# Altium schematic sheet Analog_Power_Board.SchDoc
size A3
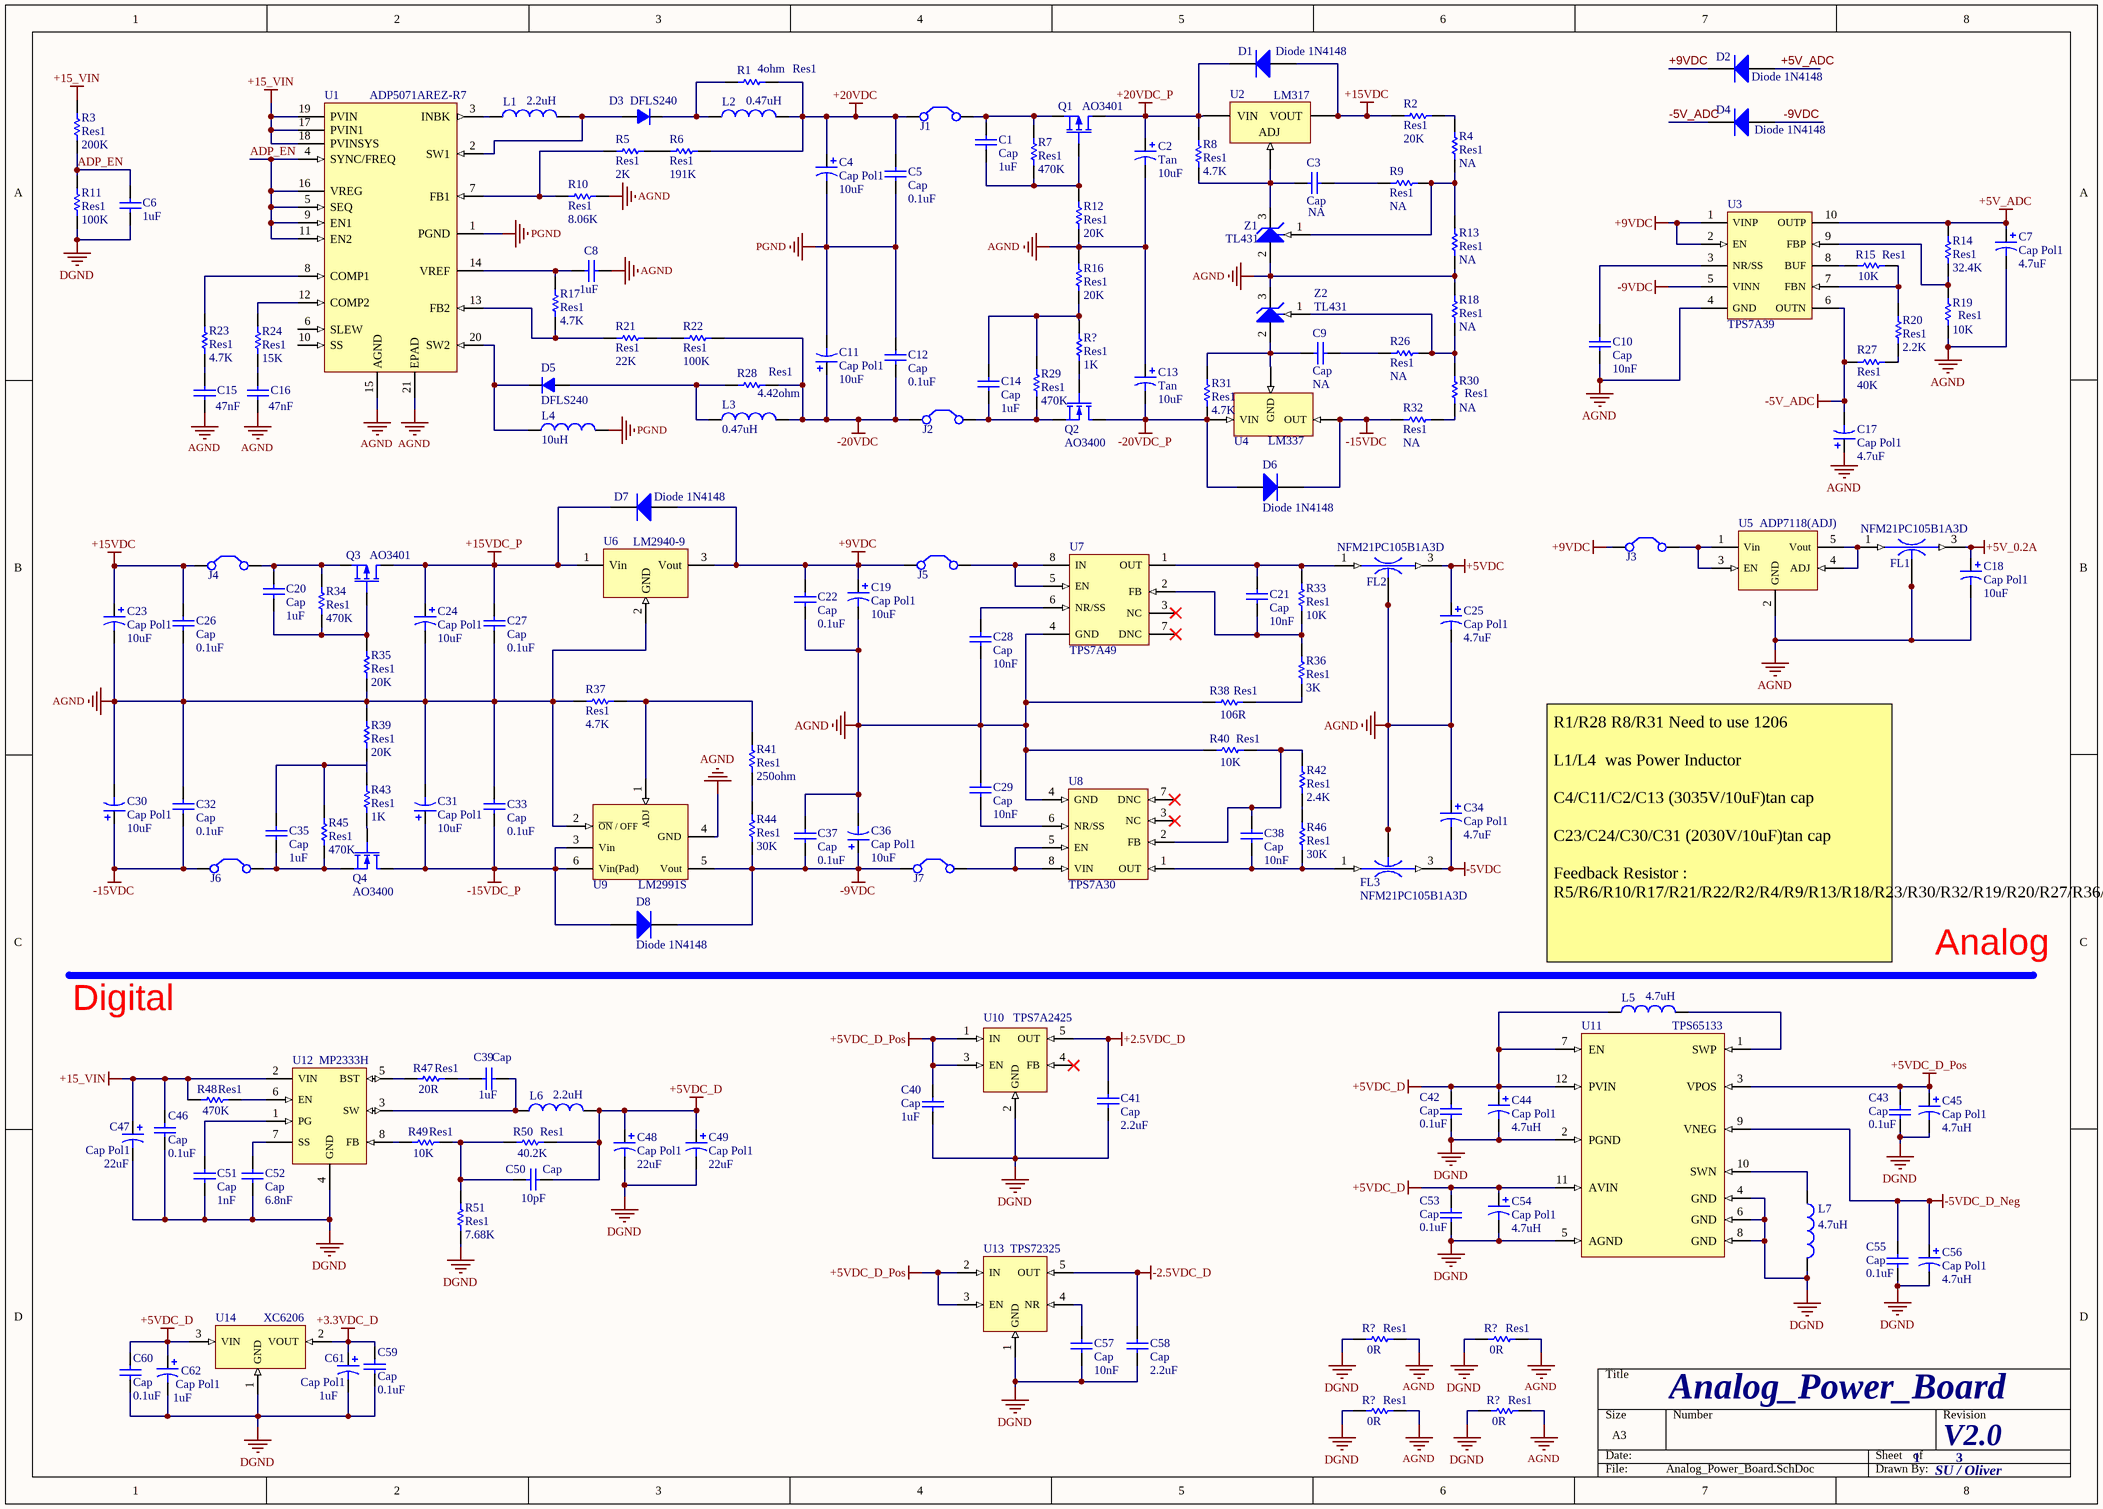
[diagram p0: Analog_Power_Board.SchDoc]

## Parts
(Parts that share a designator on the sheet are numbered #1, #2 ... from top to bottom, then left to right.)
C1  Cap  value 1uF  [C0603]
C2  Tan  value 10uF  [RB7.6-15]
C3  Cap  value NA  [C0603]
C4  Cap Pol1  value 10uF  [RB7.6-15]
C5  Cap  value 0.1uF  [C0603]
C6  value 1uF  [C0603]  (hidden comment: Cap)
C7  Cap Pol1  value 4.7uF  [RB7.6-15]
C8  value 1uF  [C0603]  (hidden comment: Cap)
C9  Cap  value NA  [C0603]
C10  Cap  value 10nF  [C0603]
C11  Cap Pol1  value 10uF  [RB7.6-15]
C12  Cap  value 0.1uF  [C0603]
C13  Tan  value 10uF  [RB7.6-15]
C14  Cap  value 1uF  [C0603]
C15  value 47nF  [C0603]  (hidden comment: Cap)
C16  value 47nF  [C0603]  (hidden comment: Cap)
C17  Cap Pol1  value 4.7uF  [RB7.6-15]
C18  Cap Pol1  value 10uF  [RB7.6-15]
C19  Cap Pol1  value 10uF  [RB7.6-15]
C20  Cap  value 1uF  [C0603]
C21  Cap  value 10nF  [C0603]
C22  Cap  value 0.1uF  [C0603]
C23  Cap Pol1  value 10uF  [RB7.6-15]
C24  Cap Pol1  value 10uF  [RB7.6-15]
C25  Cap Pol1  value 4.7uF  [RB7.6-15]
C26  Cap  value 0.1uF  [C0603]
C27  Cap  value 0.1uF  [C0603]
C28  Cap  value 10nF  [C0603]
C29  Cap  value 10nF  [C0603]
C30  Cap Pol1  value 10uF  [RB7.6-15]
C31  Cap Pol1  value 10uF  [RB7.6-15]
C32  Cap  value 0.1uF  [C0603]
C33  Cap  value 0.1uF  [C0603]
C34  Cap Pol1  value 4.7uF  [RB7.6-15]
C35  Cap  value 1uF  [C0603]
C36  Cap Pol1  value 10uF  [RB7.6-15]
C37  Cap  value 0.1uF  [C0603]
C38  Cap  value 10nF  [C0603]
C39  Cap  value 1uF  [C0603]
C40  Cap  value 1uF  [C0603]
C41  Cap  value 2.2uF  [C0603]
C42  Cap  value 0.1uF  [C0603]
C43  Cap  value 0.1uF  [C0603]
C44  Cap Pol1  value 4.7uH  [RB7.6-15]
C45  Cap Pol1  value 4.7uH  [RB7.6-15]
C46  Cap  value 0.1uF  [C0603]
C47  Cap Pol1  value 22uF  [RB7.6-15]
C48  Cap Pol1  value 22uF  [RB7.6-15]
C49  Cap Pol1  value 22uF  [RB7.6-15]
C50  Cap  value 10pF  [C0603]
C51  Cap  value 1nF  [C0603]
C52  Cap  value 6.8nF  [C0603]
C53  Cap  value 0.1uF  [C0603]
C54  Cap Pol1  value 4.7uH  [RB7.6-15]
C55  Cap  value 0.1uF  [C0603]
C56  Cap Pol1  value 4.7uH  [RB7.6-15]
C57  Cap  value 10nF  [C0603]
C58  Cap  value 2.2uF  [C0603]
C59  Cap  value 0.1uF  [C0603]
C60  Cap  value 0.1uF  [C0603]
C61  Cap Pol1  value 1uF  [RB7.6-15]
C62  Cap Pol1  value 1uF  [RB7.6-15]
D1  Diode 1N4148  [SOD-123]
D2  Diode 1N4148  [SOD-123]
D3  DFLS240  [DO-214AB]
D4  Diode 1N4148  [SOD-123]
D5  DFLS240  [DO-214AB]
D6  Diode 1N4148  [SOD-123]
D7  Diode 1N4148  [SOD-123]
D8  Diode 1N4148  [SOD-123]
FL1  NFM21PC105B1A3D  [NFM21PC105B1C3D]
FL2  NFM21PC105B1A3D  [NFM21PC105B1C3D]
FL3  NFM21PC105B1A3D  [NFM21PC105B1C3D]
J1  Jumper  [Jumper(Keystone_5015)]  (value not drawn)
J2  Jumper  [Jumper(Keystone_5015)]  (value not drawn)
J3  Jumper  [Jumper(Keystone_5015)]  (value not drawn)
J4  Jumper  [Jumper(Keystone_5015)]  (value not drawn)
J5  Jumper  [Jumper(Keystone_5015)]  (value not drawn)
J6  Jumper  [Jumper(Keystone_5015)]  (value not drawn)
J7  Jumper  [Jumper(Keystone_5015)]  (value not drawn)
L1  value 2.2uH  [0402-A]  (hidden comment: Inductor)
L2  value 0.47uH  [0402-A]  (hidden comment: Inductor)
L3  value 0.47uH  [0402-A]  (hidden comment: Inductor)
L4  value 10uH  [0402-A]  (hidden comment: Inductor)
L5  value 4.7uH  [0402-A]  (hidden comment: Inductor)
L6  value 2.2uH  [0402-A]  (hidden comment: Inductor)
L7  value 4.7uH  [0402-A]  (hidden comment: Inductor)
Q1  AO3401  [SOT23-3]
Q2  AO3400  [NMOS_SOT23]
Q3  AO3401  [SOT23-3]
Q4  AO3400  [NMOS_SOT23]
R1  Res1  value 4ohm  [R0603]
R2  Res1  value 20K  [R0603]
R3  Res1  value 200K  [R0603]
R4  Res1  value NA  [R0603]
R5  Res1  value 2K  [R0603]
R6  Res1  value 191K  [R0603]
R7  Res1  value 470K  [R0603]
R8  Res1  value 4.7K  [R0603]
R9  Res1  value NA  [R0603]
R10  Res1  value 8.06K  [R0603]
R11  Res1  value 100K  [R0603]
R12  Res1  value 20K  [R0603]
R13  Res1  value NA  [R0603]
R14  Res1  value 32.4K  [R0603]
R15  Res1  value 10K  [R0603]
R16  Res1  value 20K  [R0603]
R17  Res1  value 4.7K  [R0603]
R18  Res1  value NA  [R0603]
R19  Res1  value 10K  [R0603]
R20  Res1  value 2.2K  [R0603]
R21  Res1  value 22K  [R0603]
R22  Res1  value 100K  [R0603]
R23  Res1  value 4.7K  [R0603]
R24  Res1  value 15K  [R0603]
R26  Res1  value NA  [R0603]
R27  Res1  value 40K  [R0603]
R28  Res1  value 4.42ohm  [R0603]
R29  Res1  value 470K  [R0603]
R30  Res1  value NA  [R0603]
R31  Res1  value 4.7K  [R0603]
R32  Res1  value NA  [R0603]
R33  Res1  value 10K  [R0603]
R34  Res1  value 470K  [R0603]
R35  Res1  value 20K  [R0603]
R36  Res1  value 3K  [R0603]
R37  Res1  value 4.7K  [R0603]
R38  Res1  value 106R  [R0603]
R39  Res1  value 20K  [R0603]
R40  Res1  value 10K  [R0603]
R41  Res1  value 250ohm  [R0603]
R42  Res1  value 2.4K  [R0603]
R43  Res1  value 1K  [R0603]
R44  Res1  value 30K  [R0603]
R45  Res1  value 470K  [R0603]
R46  Res1  value 30K  [R0603]
R47  Res1  value 20R  [R0603]
R48  Res1  value 470K  [R0603]
R49  Res1  value 10K  [R0603]
R50  Res1  value 40.2K  [R0603]
R51  Res1  value 7.68K  [R0603]
R?#1  Res1  value 1K  [R0603]
R?#2  Res1  value 0R  [R0603]
R?#3  Res1  value 0R  [R0603]
R?#4  Res1  value 0R  [R0603]
R?#5  Res1  value 0R  [R0603]
U1  ADP5071AREZ-R7  [TSSOP-20-PAD]
U2  LM317  [TO-252-2-L]
U3  TPS7A39
U4  LM337  [TO-252-2-L]
U5  ADP7118(ADJ)
U6  LM2940-9
U7  TPS7A49
U8  TPS7A30
U9  LM2991S
U10  TPS7A2425
U11  TPS65133  [WSON-12]
U12  MP2333H
U13  TPS72325
U14  XC6206
Z1  TL431  [SOT-89]
Z2  TL431  [SOT-89]

## Nets
+2.5VDC_D: C41.2 U10.5(OUT)
+3.3VDC_D: C59.1 C61.1 U14.2(VOUT)
+5V_0.2A: C18.1 FL1.3(OUT)
+5V_ADC: C7.1 D2.1(A) R14.2 U3.10(OUTP)
+5VDC: C25.1 FL2.3(OUT)
+5VDC_D: C42.1 C44.1 C48.1 C49.1 C50.1 C53.1 C54.1 C60.1 C62.1 L5.1 L6.2 R50.1 U11.7(EN) U11.11(AVIN) U11.12(PVIN) U14.3(VIN)
+5VDC_D_Pos: C40.1 C43.1 C45.1 U10.1(IN) U10.3(EN) U11.3(VPOS) U13.2(IN) U13.3(EN)
+9VDC: C19.1 C22.1 D2.2(K) D7.1(A) J3.1(C1) J5.1(C1) U3.1(VINP) U3.2(EN) U6.3(Vout)
+15_VIN: C46.1 C47.1 R3.2 R48.2 U1.17(PVIN1) U1.18(PVINSYS) U1.19(PVIN) U12.2(VIN)
+15VDC: C23.1 C26.2 D1.1(A) J4.1(C1) R2.1 U2.4(VOUT)
+15VDC_P: C24.1 C27.2 D7.2(K) Q3.3(D) U6.1(Vin)
+20VDC: C4.1 C5.2 J1.1(C1) L2.2 R1.1 R6.1
+20VDC_P: C2.1 D1.2(K) Q1.3(D) R8.2 U2.3(VIN)
-2.5VDC_D: C58.2 U13.5(OUT)
-5V_ADC: C17.2 D4.2(K) R27.1 U3.6(OUTN)
-5VDC: C34.2 FL3.3(OUT)
-5VDC_D_Neg: C55.1 C56.1 U11.9(VNEG)
-9VDC: C36.1 C37.1 D4.1(A) D8.2(K) J7.1(C1) R44.1 U3.5(VINN) U9.5(Vout)
-15VDC: C30.1 C32.1 D6.2(K) J6.1(C1) R32.2 U4.3(OUT)
-15VDC_P: C31.1 C33.1 D8.1(A) Q4.3(D) U9.3(Vin) U9.6(Vin(Pad))
-20VDC: C11.1 C12.1 J2.1(C1) L3.2 R22.2 R28.1
-20VDC_P: C13.2 D6.1(A) Q2.3(D) R31.2 U4.4(VIN)
AGND: C2.2 C7.2 C8.2 C10.1 C13.1 C15.1 C16.1 C17.1 C18.2 C19.2 C22.2 C23.2 C24.2 C25.2 C26.1 C27.1 C28.2 C29.2 C30.2 C31.2 C32.2 C33.2 C34.1 C36.2 C37.2 FL1.2(GND) FL1.2_1(GND) FL1.2_3(GND) FL2.2(GND) FL2.2_1(GND) FL2.2_3(GND) FL3.2(GND) FL3.2_1(GND) FL3.2_3(GND) R10.1 R12.2 R13.2 R16.1 R18.2 R19.1 R35.2 R37.2 R38.2 R39.1 R40.2 R?#2.1 R?#3.1 R?#4.1 R?#5.1 U1.15(AGND) U1.21(EPAD) U3.4(GND) U5.2(GND) U6.2(GND) U7.4(GND) U8.4(GND) U9.2(~{ON}_/_OFF) U9.4(GND) Z1.2(ANODE) Z2.3(CATHODE)
DGND: C6.1 C40.2 C41.1 C42.2 C43.2 C44.2 C45.2 C46.2 C47.2 C48.2 C49.2 C51.1 C52.1 C53.2 C54.2 C55.2 C56.2 C57.1 C58.1 C59.2 C60.2 C61.2 C62.2 L7.2 R11.2 R51.1 R?#2.2 R?#3.2 R?#4.2 R?#5.2 U10.2(GND) U11.2(PGND) U11.4(GND) U11.5(AGND) U11.6(GND) U11.8(GND) U12.4(GND) U13.1(GND) U14.1(GND)
PGND: C4.2 C5.1 C11.2 C12.2 L4.2 U1.1(PGND)
ADP_EN: C6.2 R3.1 R11.1 U1.4(SYNC/FREQ) U1.5(SEQ) U1.9(EN1) U1.11(EN2) U1.16(VREG)
NetC1_1: C1.1 Q1.1(G) R7.1 R12.1
NetC1_2: C1.2 J1.2(C2) Q1.2(S) R7.2
NetC3_1: C3.1 R9.2
NetC3_2: C3.2 R8.1 U2.1(ADJ) Z1.3(CATHODE)
NetC8_1: C8.1 R17.2 U1.14(VREF)
NetC9_1: C9.1 R26.2
NetC9_2: C9.2 R31.1 U4.1(GND) Z2.2(ANODE)
NetC10_2: C10.2 U3.3(NR/SS)
NetC14_1: C14.1 J2.2(C2) Q2.2(S) R29.1
NetC14_2: C14.2 R16.2 R29.2 R?#1.2
NetC15_2: C15.2 R23.1
NetC16_2: C16.2 R24.1
NetC20_1: C20.1 Q3.1(G) R34.1 R35.1
NetC20_2: C20.2 J4.2(C2) Q3.2(S) R34.2
NetC21_1: C21.1 R33.1 R36.2 U7.2(FB)
NetC21_2: C21.2 FL2.1(IN) R33.2 U7.1(OUT)
NetC28_1: C28.1 U7.6(NR/SS)
NetC29_1: C29.1 U8.6(NR/SS)
NetC35_1: C35.1 J6.2(C2) Q4.2(S) R45.1
NetC35_2: C35.2 R39.2 R43.2 R45.2
NetC38_1: C38.1 FL3.1(IN) R46.2 U8.1(OUT)
NetC38_2: C38.2 R40.1 R42.2 U8.2(FB)
NetC39_1: C39.1 L6.1 U12.3(SW)
NetC39_2: C39.2 R47.1
NetC50_2: C50.2 R49.1 R50.2 R51.2
NetC51_2: C51.2 U12.1(PG)
NetC52_2: C52.2 U12.7(SS)
NetC57_2: C57.2 U13.4(NR)
NetD3_A: D3.A L1.2 U1.2(SW1)
NetD3_K: D3.K L2.1 R1.2
NetD5_A: D5.A L3.1 R28.2
NetD5_K: D5.K L4.1 U1.20(SW2)
NetFL1_1: FL1.1(IN) U5.4(ADJ) U5.5(Vout)
NetJ3_2: J3.2(C2) U5.1(Vin) U5.3(EN)
NetJ5_2: J5.2(C2) U7.5(EN) U7.8(IN)
NetJ7_2: J7.2(C2) U8.5(EN) U8.8(VIN)
NetL1_1: L1.1 U1.3(INBK)
NetL5_2: L5.2 U11.1(SWP)
NetL7_1: L7.1 U11.10(SWN)
NetQ2_1: Q2.1(G) R?#1.1
NetQ4_1: Q4.1(G) R43.1
NetR2_2: R2.2 R4.1
NetR4_2: R4.2 R9.1 R13.1 Z1.1(REF)
NetR5_1: R5.1 R6.2
NetR5_2: R5.2 R10.2 U1.7(FB1)
NetR14_1: R14.1 R19.2 U3.9(FBP)
NetR15_1: R15.1 U3.8(BUF)
NetR15_2: R15.2 R20.1 U3.7(FBN)
NetR17_1: R17.1 R21.1 U1.13(FB2)
NetR18_1: R18.1 R26.1 R30.2 Z2.1(REF)
NetR20_2: R20.2 R27.2
NetR21_2: R21.2 R22.1
NetR23_2: R23.2 U1.8(COMP1)
NetR24_2: R24.2 U1.12(COMP2)
NetR30_1: R30.1 R32.1
NetR36_1: R36.1 R38.1
NetR37_1: R37.1 R41.2 U9.1(ADJ)
NetR41_1: R41.1 R44.2
NetR42_1: R42.1 R46.1
NetR47_2: R47.2 U12.5(BST)
NetR48_1: R48.1 U12.6(EN)
NetR49_2: R49.2 U12.8(FB)

Not connected (* = marked no-connect by the designer): U1 6(SLEW) 10(SS); U7 3(NC)* 7(DNC)*; U8 3(NC)* 7(DNC)*; U10 4(FB)*

## Notes on the sheet
- (near L5) R1/R28 R8/R31 Need to use 1206
  L1/L4  was Power Inductor
  C4/C11/C2/C13 (3035V/10uF)tan cap
  C23/C24/C30/C31 (2030V/10uF)tan cap
  Feedback Resistor : R5/R6/R10/R17/R21/R22/R2/R4/R9/R13/R18/R23/R30/R32/R19/R20/R27/R36/R38/R42/R46/R41/R44/R49/R51
- Analog
- Digital
- Analog_Power_Board
- 1
- V2.0
- 3
- SU / Oliver

## Library data of the parts
C1 C3 C5 C6 C8-C10 C12 C14-C16 C20-C22 C26-C29 C32 C33 C35 C37-C43 C46 C50-C53 C55 C57-C60 = Cap: Capacitor; Published: 8-Jun-2000; LatestRevisionDate: 17-Jul-2002; LatestRevisionNote: Re-released for DXP Platform.; PackageReference: RAD-0.3; Publisher: Altium Limited; PackageDescription: Radial Cap, Thru-Hole; 2 Leads; 0.3 in Pin Spacing
C2 C4 C7 C11 C13 C17-C19 C23-C25 C30 C31 C34 C36 C44 C45 C47-C49 C54 C56 C61 C62 = Cap Pol1: Polarized Capacitor (Radial); Published: 8-Jun-2000; LatestRevisionDate: 17-Jul-2002; LatestRevisionNote: Re-released for DXP Platform.; PackageReference: RB7.6-15; Publisher: Altium Limited; PackageDescription: Polarized Capacitor (Radial); 2 Leads
D1 D2 D4 D6-D8 = Diode 1N4148: High Conductance Fast Diode; Published: 8-Jun-2000; LatestRevisionDate: 17-Jul-2002; LatestRevisionNote: Re-released for DXP Platform.; DatasheetVersion: 1997; PackageReference: DO-35; Publisher: Altium Limited; PackageDescription: Diode, Axial; Body 3.8 x 1.9 mm (LxDia. max), Lead Dia. 0.53 mm (max); Code_JEDEC: DO-204-AH; ComponentLink1Description: Manufacturer Link; ComponentLink1URL: http://www.fairchildsemi.com/; ComponentLink2Description: Datasheet; ComponentLink2URL: http://www.fairchildsemi.com/ds/1N%2F1N4148.pdf
D3 D5 = DIODE 1N5817
FL1-FL3 = NFM21PC105B1A3D: SMD Capacitor with Capacitance: 1.0uF Tol. 20%. Rated Voltage: 10Vdc; MF: Murata; Value: *; Package: NONSTANDARD; Price: None; MP: NFM21PC105B1A3D; Availability: Unavailable; SnapEDA_Link: https://www.snapeda.com/parts/NFM21PC105B1A3D/Murata/view-part/4380627/?ref=snap
L1-L7 = Inductor: Code_IEC: 1005; Published: 8-Jun-2000; LatestRevisionDate: 29-May-2009; LatestRevisionNote: IPC-7351 Footprint Added.; PackageReference: 0402-A; Publisher: Altium Limited; PackageDescription: Chip Inductor; Code_JEITA: 0402
Q1 Q3 = PMOS
Q2 Q4 = NMOS
R1-R24 R26-R51 R?#1-R?#5 = Res1: Resistor; Published: 8-Jun-2000; LatestRevisionDate: 17-Jul-2002; LatestRevisionNote: Re-released for DXP Platform.; PackageReference: AXIAL-0.3; Publisher: Altium Limited; PackageDescription: Axial Device, Thru-Hole; 2 Leads; 0.3 in Pin Spacing
U1 = ADP5071AREZ-R7: 2 A/1.2 A DC-to-DC Switching Regulator with / Independent Positive and Negative Outputs; ComponentLink1Description: ADP5071AREZ-R7; ComponentLink1URL: https://www.analog.com/media/en/technical-documentation/data-sheets/ADP5071.pdf
U2 = LM317MDT-TR: LM317 3-Terminal Adjustable Regulato (positive Voltage); ComponentLink1Description: LM317; ComponentLink1URL: https://www.ti.com/lit/ds/symlink/lm317.pdf?ts=1647480882042&ref_url=https%253A%252F%252Fwww.google.com%252F
U3 = TPS7A3901DSCR: TPS7A39 Dual, 150-mA, Wide VIN Positive and Negative LDO Voltage Regulator; ComponentLink1Description: TPS7A39; ComponentLink1URL: https://www.ti.com/lit/ds/symlink/tps7a39.pdf?ts=1676505105907&ref_url=https%253A%252F%252Fwww.google.com%252F
U4 = LM337KTT: LMx37 3-Terminal Adjustable Regulator (Negaitive Voltage); ComponentLink1Description: LM337; ComponentLink1URL: https://www.ti.com/lit/ds/slvs047l/slvs047l.pdf?ts=1648226707329&ref_url=https%253A%252F%252Fwww.google.com%252F
U5 = ADP7118AUJZ-R7: 20 V, 200 mA, Low Noise,CMOS LDO Linear Regulator (For ADJ Voltage , Not Constant Voltage); ComponentLink1Description: ADP7118; ComponentLink1URL: https://www.analog.com/media/en/technical-documentation/data-sheets/adp7118.pdf
U6 = LM2940-9: LM2940x 1-A Low Dropout Regulato For 9V output; ComponentLink1Description: LM2940x; ComponentLink1URL: https://www.ti.com/lit/ds/symlink/lm2940-n.pdf?ts=1676543115219&ref_url=https%253A%252F%252Fwww.google.com%252F
U7 = TPS7A4901DGN: TPS7A49 36-V, 150-mA, Ultralow-Noise, Positive Linear Regulator; ComponentLink1Description: TPS7A49; ComponentLink1URL: https://www.ti.com/lit/ds/symlink/tps7a49.pdf?ts=1676510387342&ref_url=https%253A%252F%252Fwww.ti.com%252Fproduct%252FTPS7A49%253FkeyMatch%253DTPS7A49%2526tisearch%253Dsearch-everything%2526usecase%253DGPN
U8 = TPS7A3001DGN: TPS7A30 –35-V, –200-mA, Ultralow-Noise, Negative Linear Regulator; ComponentLink1Description: TPS7A30; ComponentLink1URL: https://www.ti.com/lit/ds/symlink/tps7a30.pdf?ts=1676571584048&ref_url=https%253A%252F%252Fwww.google.com%252F
U9 = LM2991S: LM2991 Negative Low-Dropout Adjustable Regulator
U10 = TPS7A2425DBVR: TPS7A24 200-mA, 18-V, Ultra-Low IQ, Low-Dropout Voltage Regulator; ComponentLink1Description: TPS7A2425; ComponentLink1URL: https://www.ti.com/lit/ds/symlink/tps7a24.pdf?ts=1676574760844&ref_url=https%253A%252F%252Fwww.google.com%252F
U11 = TPS65133DPDR: TPS65133 ±5-V, 250-mA Dual-Output Power Supply; ComponentLink1Description: TPS65133; ComponentLink1URL: https://www.ti.com/lit/ds/symlink/tps65133.pdf?ts=1676534660350&ref_url=https%253A%252F%252Fwww.ti.com%252Fproduct%252FTPS65133
U12 = MP2333H: 4.2 - 18V Input, 3A, 1.2MHz / Synchronous Buck Converter / with Power Good and Soft Start / in SOT583 (1.6x2mm) Package; ComponentLink1Description: MP2333H; ComponentLink1URL: https://www.monolithicpower.com/en/documentview/productdocument/index/version/2/document_type/Datasheet/lang/en/sku/MP2333H/document_id/4409/
U13 = TPS72325DB: TPS723 200-mA, Low-Noise, High-PSRR,Negative Output Low-Dropout Linear Regulators.; ComponentLink1Description: TPS723; ComponentLink1URL: https://www.ti.com/lit/ds/symlink/tps723.pdf?ts=1676575233890&ref_url=https%253A%252F%252Fwww.google.com%252F
U14 = XC6206: Low ESR Cap. Compatible Positive  Voltage Regulators.; ComponentLink1Description: XC6206; ComponentLink1URL: https://www.torexsemi.com/file/xc6206/XC6206.pdf
Z1 Z2 = TL431: TL431Precision Programmable Reference 50ppm B_case(+/-0.5%) A_case(+/-1%) Standard(+/-2%)